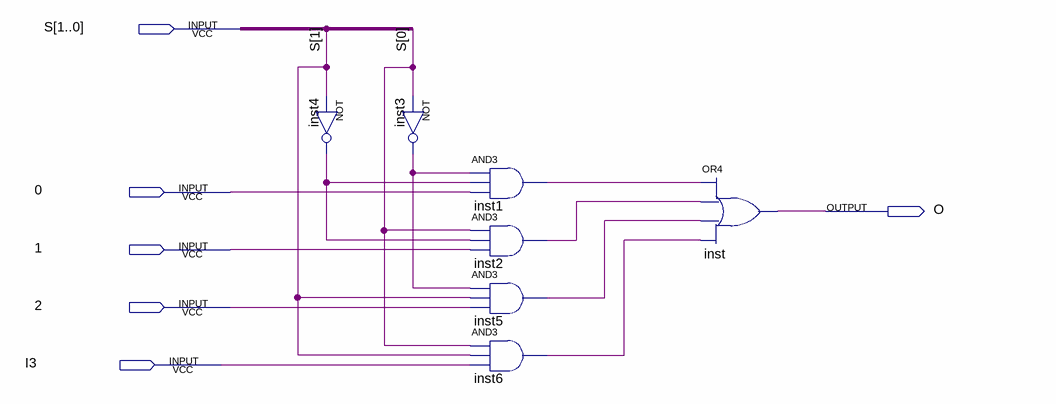
[diagram p0: schematic sheet]
// Quartus schematic Mux4To1.bdf as structural Verilog: 7 symbols, 6 pins
module Mux4To1 (
  input  [1:0] S,
  input  \0 ,
  input  \1 ,
  input  \2 ,
  input  I3,
  output O
);

  wire inst1_out, inst2_out, inst3_out, inst4_out, inst5_out, inst6_out;

  not inst4 (inst4_out, S[1]);
  not inst3 (inst3_out, S[0]);
  and inst1 (inst1_out, inst3_out, inst4_out, \0 );
  and inst2 (inst2_out, S[0], inst4_out, \1 );
  and inst5 (inst5_out, inst3_out, S[1], \2 );
  and inst6 (inst6_out, S[0], S[1], I3);
  or inst (O, inst1_out, inst2_out, inst5_out, inst6_out);
endmodule
